# EAGLE schematic microphone (EAGLE 6.6.0)
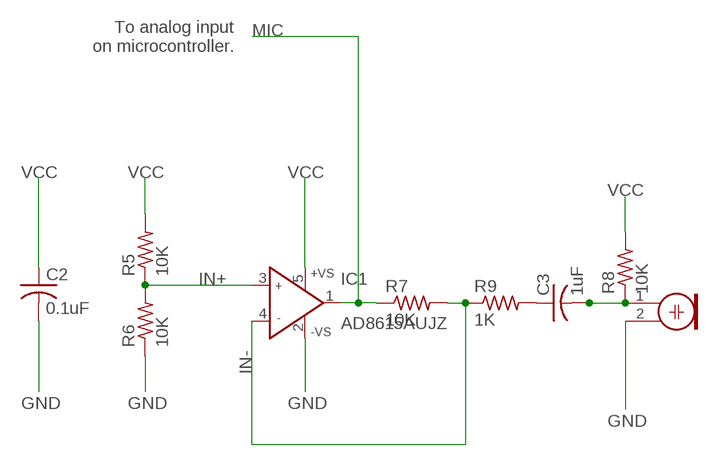
[diagram p0: schematic, sheet 1]

## Parts
C2  0.1uF  C-USC1206  [C1206]
C3  1uF  C-USC1206  [C1206]
IC1  AD8615AUJZ  AD8614RJ  [SOT23-5]
M1  ELECTRETTH  [ELECTRET_6MM_TH]
R5  10K  R-US_R1206  [R1206]
R6  10K  R-US_R1206  [R1206]
R7  10K  R-US_R1206  [R1206]
R8  10K  R-US_R1206  [R1206]
R9  1K  R-US_R1206  [R1206]

## Nets
GND: C2.2 IC1.2(-VS) M1.2 R6.1
IN+: IC1.3(IN+) R5.1 R6.2
IN-: IC1.4(IN-) R7.2 R9.1
MIC: IC1.1(OUT) R7.1
N$4: C3.2 M1.1 R8.1
N$6: C3.1 R9.2
VCC: C2.1 IC1.5(+VS) R5.2 R8.2

## Notes on the sheet
- To analog input
  on microcontroller.

## Library data of the parts
C2 C3 = rcl:C-US: CAPACITOR, American symbol
IC1 = analog-devices:AD8614: Single and Quad 18 V Operational Amplifiers Source: http://www.analog.com/static/imported-files/data_sheets/AD8614_8644.pdf; MF: ALTERA CORPORATION; MPN: AD8614ARTZ-REEL7; OC_FARNELL: 1464998; OC_NEWARK: 88H0303
M1 = LED Light:ELECTRET
R5-R9 = rcl:R-US_: RESISTOR, American symbol